# Altium schematic sheet power.SchDoc
size A4; DocumentNumber: P25; SheetNumber: 5; SheetTotal: 5
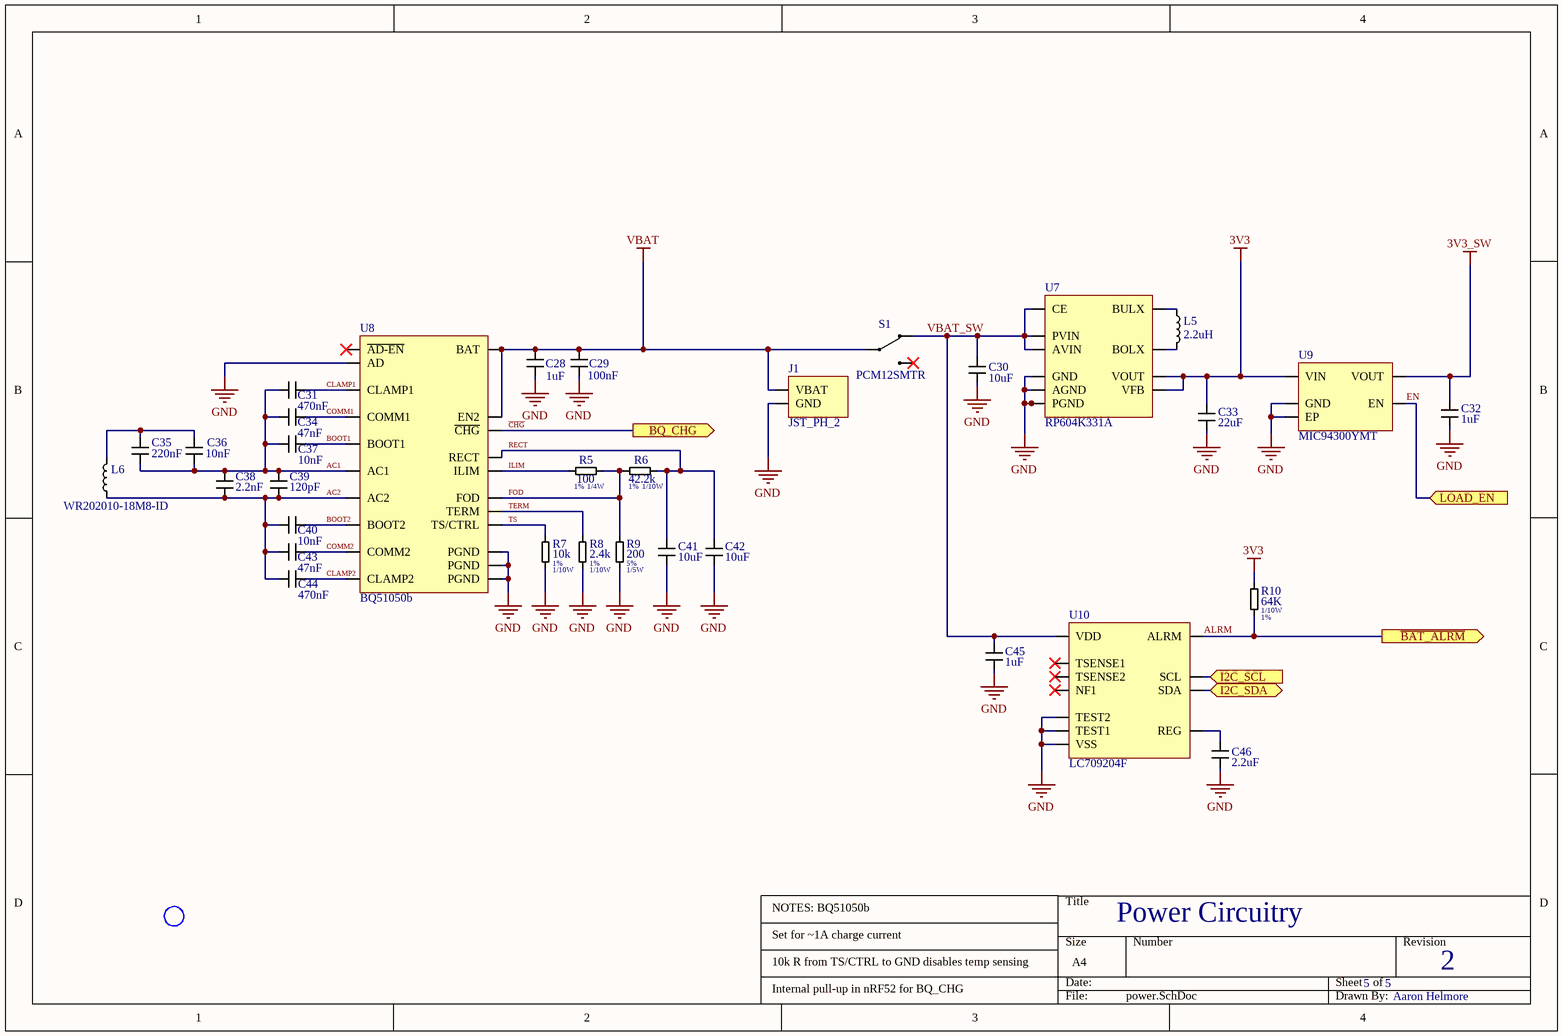
[diagram p0: power.SchDoc]

## Parts
C28  1uF  [CAP_0402]
C29  100nF  [CAP_0402]
C30  10uF  [CAP_0603]
C31  470nF  [CAP_0603]
C32  1uF  [CAP_0402]
C33  22uF  [CAP_0603]
C34  47nF  [CAP_0402]
C35  220nF  [CAP_0402]
C36  10nF  [CAP_0402]
C37  10nF  [CAP_0402]
C38  2.2nF  [CAP_0402]
C39  120pF  [CAP_0402]
C40  10nF  [CAP_0402]
C41  10uF  [CAP_0603]
C42  10uF  [CAP_0603]
C43  47nF  [CAP_0402]
C44  470nF  [CAP_0603]
C45  1uF  [CAP_0402]
C46  2.2uF  [CAP_0603]
J1  JST_PH_2  [JST PH2 SMT]
L5  2.2uH  [LQM2MPNxxxx]
L6  WR202010-18M8-ID  [WR202010]
R5  100  Tolerance: 1%  Wattage: 1/4W  [RES_0402]
R6  42.2k  Tolerance: 1%  Wattage: 1/10W  [RES_0402]
R7  10k  Tolerance: 1%  Wattage: 1/10W  [RES_0402]
R8  2.4k  Tolerance: 1%  Wattage: 1/10W  [RES_0402]
R9  200  Tolerance: 5%  Wattage: 1/5W  [RES_0402]
R10  64K  Wattage: 1/10W  Tolerance: 1%  [RES_0402]
RXCOIL1  RXCOIL_MISC  [RX_COIL_MISC]  (value not drawn)
S1  PCM12SMTR  [PCM12SMTR]
U7  RP604K331A  [UDFN-12]
U8  BQ51050b  [BQ51050b-VQFN]
U9  MIC94300YMT  [MIC94300YMT]
U10  LC709204F  [LC709204F]

## Ports
BQ_CHG (out), I2C_SCL (in), I2C_SDA (bidir), LOAD_EN (in), ~{BAT_ALRM} (out)

## Nets
3V3: C33.2(J11) R10.1 U7.6(VFB) U7.7(VOUT) U9.4(VIN)
3V3_SW: C32.2(J11) U9.3(VOUT)
GND: C28.1(J12) C29.1(J12) C30.1(J12) C32.1(J12) C33.1(J12) C41.1(J12) C42.1(J12) C45.1(J12) C46.1(J12) J1.2(GND) R7.2 R8.2 R9.2 U7.3(PGND) U7.4(PGND) U7.5(AGND) U7.9(PGND) U7.10(PGND) U7.13(GND) U8.0(PGND) U8.1(PGND) U8.9(AD) U8.20(PGND) U9.2(GND) U9.EP1(EP) U10.A2(VSS) U10.B2(TEST2) U10.C2(TEST1)
VBAT: C28.2(J11) C29.2(J11) J1.1(VBAT) S1.2 U8.4(BAT) U8.11(EN2)
AC1: C31.2(J11) C34.2(J11) C35.1(J12) C36.1(J12) C37.1(J12) C38.2(J11) C39.2(J11) U8.2(AC1)
AC2: C38.1(J12) C39.1(J12) C40.2(J11) C43.2(J11) C44.2(J11) L6.1 U8.19(AC2)
ALRM: R10.2 U10.C1(ALRM) ; port ~{BAT_ALRM}
BOOT1: C37.2(J11) U8.3(BOOT1)
BOOT2: C40.1(J12) U8.17(BOOT2)
~{CHG}: U8.7(~{CHG}) ; port BQ_CHG
CLAMP1: C31.1(J12) U8.5(CLAMP1)
CLAMP2: C44.1(J12) U8.16(CLAMP2)
COMM1: C34.1(J12) U8.6(COMM1)
COMM2: C43.1(J12) U8.15(COMM2)
EN: U9.1(EN) ; port LOAD_EN
FOD: R5.2 R6.1 R9.1 U8.14(FOD)
I2C_SCL: U10.A1(SCL) ; port I2C_SCL
I2C_SDA: U10.B1(SDA) ; port I2C_SDA
ILIM: R5.1 U8.12(ILIM)
RECT: C41.2(J11) C42.2(J11) R6.2 U8.18(RECT)
TERM: R8.1 U8.10(TERM)
TS: R7.1 U8.13(TS/CTRL)
VBAT_SW: C30.2(J11) C45.2(J11) S1.1 U7.1(AVIN) U7.2(CE) U7.12(PVIN) U10.A4(VDD)
NetC35_2: C35.2(J11) C36.2(J11) L6.2
NetC46_2: C46.2(J11) U10.A3(REG)
NetL5_1: L5.1 U7.11(BULX)
NetL5_2: L5.2 U7.8(BOLX)

Not connected (* = marked no-connect by the designer): S1 3*; U8 8(~{AD-EN})*; U10 B3(TSENSE2)* B4(TSENSE1)* C3(NF1)*

## Notes on the sheet
- Power Circuitry
- 5
- 2
- NOTES: BQ51050b
  Set for ~1A charge current
  10k R from TS/CTRL to GND disables temp sensing
  Internal pull-up in nRF52 for BQ_CHG
- Aaron Helmore

## Library data of the parts
C28-C30 C32 C35 C41 C42 C45 C46 = Capacitor: Dielectric: X5R; Voltage: 25V
C31 C34 C36 C37 C40 C43 C44 = Capacitor: Dielectric: X7R; Voltage: 25V
C33 = Capacitor: Dielectric: X5R; Voltage: 10V
C38 C39 = Capacitor: Dielectric: X7R; Voltage: 50V
J1 = JST_PH_2: JST PH series connector with 2 pins 1 row
L5 L6 = Inductor
R5-R10 = R_Small
S1 = PCM12SMTR: CK Switches 300mA 6VDC SMT right-angle slide switch
U7 = RP604K331A: Nisshinbo Ultra-low quiescent current, 300mA, Buck-Boost DC/DC converter
U8 = BQ51050b: Single stage wireless power receiver and Li-Ion/Li-Pol battery charger. Qi compatible
U9 = MIC94300YMT: 200mA load switch
U10 = LC709204F: onsemi I2C Li-Ion/Li-Poly Fuel Gauge